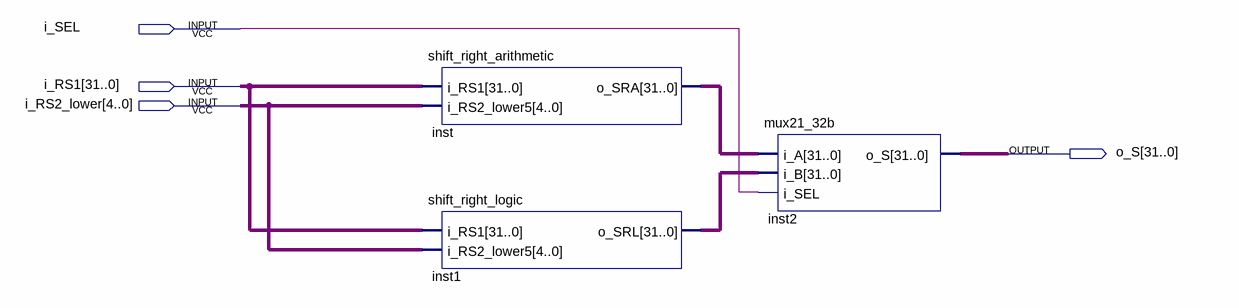
[diagram p0: schematic sheet]
// Quartus schematic srl_sra.bdf as structural Verilog: 3 symbols, 4 pins
module srl_sra (
  input  i_SEL,
  input  [31:0] i_RS1,
  input  [4:0] i_RS2_lower,
  output [31:0] o_S
);

  wire [31:0] inst1_o_srl, inst_o_sra;

  shift_right_arithmetic inst (.i_RS1(i_RS1), .i_RS2_lower5(i_RS2_lower), .o_SRA(inst_o_sra));
  shift_right_logic inst1 (.i_RS1(i_RS1), .i_RS2_lower5(i_RS2_lower), .o_SRL(inst1_o_srl));
  mux21_32b inst2 (.i_A(inst_o_sra), .i_B(inst1_o_srl), .i_SEL(i_SEL), .o_S(o_S));
endmodule
